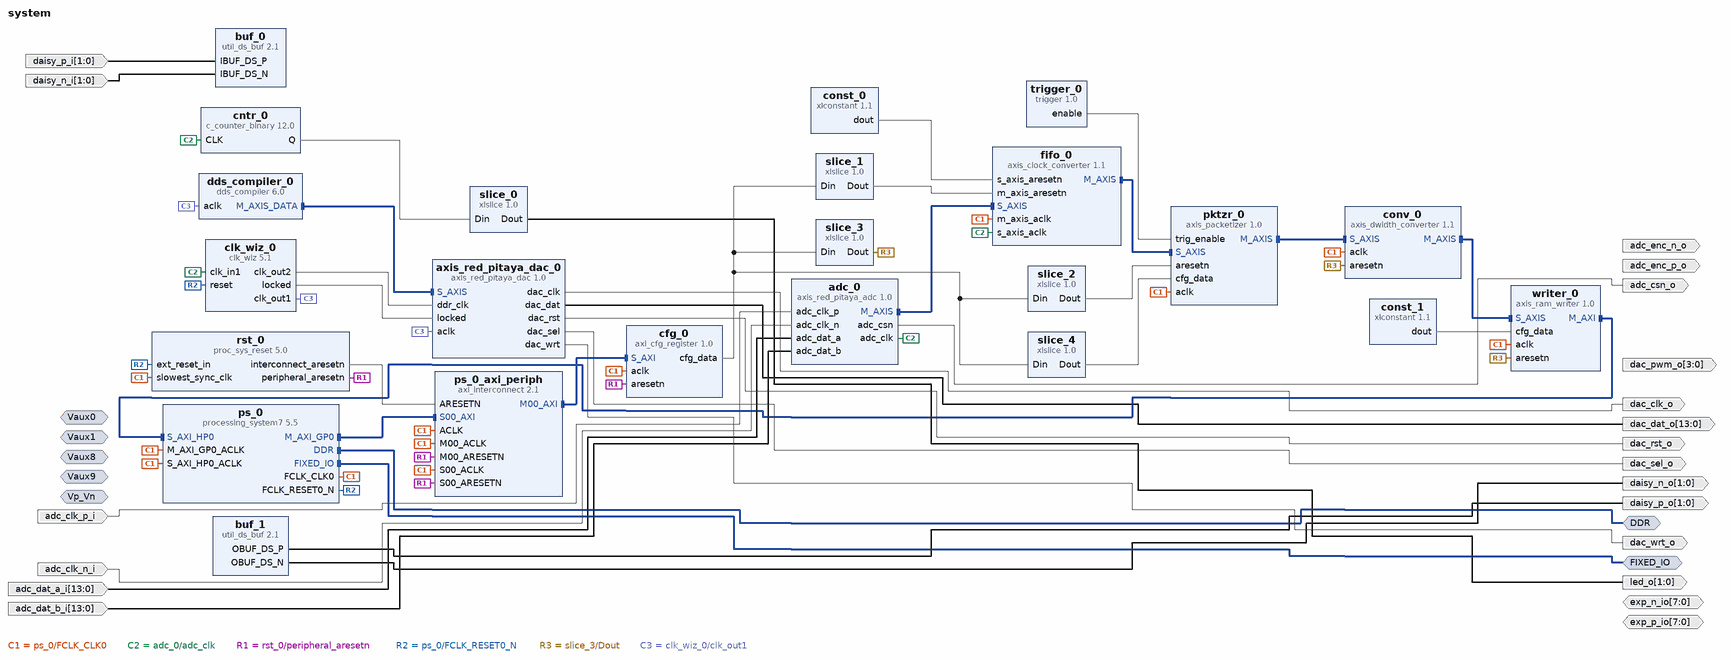
[diagram p0: block diagram of the top level]
# Vivado block design system, Vivado 2015.2
create_bd_design system

create_bd_intf_port -mode Master -vlnv xilinx.com:interface:ddrx_rtl:1.0 DDR
create_bd_intf_port -mode Master -vlnv xilinx.com:display_processing_system7:fixedio_rtl:1.0 FIXED_IO
create_bd_intf_port -mode Slave -vlnv xilinx.com:interface:diff_analog_io_rtl:1.0 Vp_Vn
create_bd_intf_port -mode Slave -vlnv xilinx.com:interface:diff_analog_io_rtl:1.0 Vaux0
create_bd_intf_port -mode Slave -vlnv xilinx.com:interface:diff_analog_io_rtl:1.0 Vaux1
create_bd_intf_port -mode Slave -vlnv xilinx.com:interface:diff_analog_io_rtl:1.0 Vaux9
create_bd_intf_port -mode Slave -vlnv xilinx.com:interface:diff_analog_io_rtl:1.0 Vaux8
create_bd_port -dir O adc_enc_p_o
create_bd_port -dir O adc_enc_n_o
create_bd_port -dir O -from 3 -to 0 dac_pwm_o
create_bd_port -dir IO -from 7 -to 0 exp_p_io
create_bd_port -dir IO -from 7 -to 0 exp_n_io
create_bd_port -dir I -from 1 -to 0 daisy_p_i
create_bd_port -dir I -from 1 -to 0 daisy_n_i
create_bd_port -dir O -from 1 -to 0 daisy_p_o
create_bd_port -dir O -from 1 -to 0 daisy_n_o
create_bd_port -dir I adc_clk_p_i
create_bd_port -dir I adc_clk_n_i
create_bd_port -dir I -from 13 -to 0 adc_dat_a_i
create_bd_port -dir I -from 13 -to 0 adc_dat_b_i
create_bd_port -dir O adc_csn_o
create_bd_port -dir O -from 1 -to 0 led_o
create_bd_port -dir O dac_clk_o
create_bd_port -dir O -from 13 -to 0 dac_dat_o
create_bd_port -dir O dac_rst_o
create_bd_port -dir O dac_sel_o
create_bd_port -dir O dac_wrt_o

create_bd_cell -type ip -vlnv xilinx.com:ip:processing_system7:5.5 ps_0
set_property -dict {CONFIG.PCW_USE_S_AXI_HP0 1 CONFIG.PCW_IMPORT_BOARD_PRESET cfg/red_pitaya.xml} [get_bd_cells ps_0]
create_bd_cell -type ip -vlnv xilinx.com:ip:proc_sys_reset:5.0 rst_0
create_bd_cell -type ip -vlnv xilinx.com:ip:util_ds_buf:2.1 buf_0
set_property -dict {CONFIG.C_SIZE 2 CONFIG.C_BUF_TYPE IBUFDS} [get_bd_cells buf_0]
create_bd_cell -type ip -vlnv xilinx.com:ip:util_ds_buf:2.1 buf_1
set_property -dict {CONFIG.C_SIZE 2 CONFIG.C_BUF_TYPE OBUFDS} [get_bd_cells buf_1]
create_bd_cell -type ip -vlnv pavel-demin:user:axis_red_pitaya_adc:1.0 adc_0
create_bd_cell -type ip -vlnv xilinx.com:ip:c_counter_binary:12.0 cntr_0
set_property -dict {CONFIG.Output_Width 32} [get_bd_cells cntr_0]
create_bd_cell -type ip -vlnv xilinx.com:ip:xlslice:1.0 slice_0
set_property -dict {CONFIG.DOUT_WIDTH 2 CONFIG.DIN_TO 25 CONFIG.DIN_FROM 26 CONFIG.DIN_WIDTH 32} [get_bd_cells slice_0]
create_bd_cell -type ip -vlnv pavel-demin:user:axi_cfg_register:1.0 cfg_0
set_property -dict {CONFIG.CFG_DATA_WIDTH 64 CONFIG.AXI_DATA_WIDTH 32 CONFIG.AXI_ADDR_WIDTH 32} [get_bd_cells cfg_0]
create_bd_cell -type ip -vlnv xilinx.com:ip:xlslice:1.0 slice_1
set_property -dict {CONFIG.DOUT_WIDTH 1 CONFIG.DIN_TO 0 CONFIG.DIN_FROM 0 CONFIG.DIN_WIDTH 64} [get_bd_cells slice_1]
create_bd_cell -type ip -vlnv xilinx.com:ip:xlslice:1.0 slice_2
set_property -dict {CONFIG.DOUT_WIDTH 1 CONFIG.DIN_TO 1 CONFIG.DIN_FROM 1 CONFIG.DIN_WIDTH 64} [get_bd_cells slice_2]
create_bd_cell -type ip -vlnv xilinx.com:ip:xlslice:1.0 slice_3
set_property -dict {CONFIG.DOUT_WIDTH 1 CONFIG.DIN_TO 2 CONFIG.DIN_FROM 2 CONFIG.DIN_WIDTH 64} [get_bd_cells slice_3]
create_bd_cell -type ip -vlnv xilinx.com:ip:xlslice:1.0 slice_4
set_property -dict {CONFIG.DOUT_WIDTH 32 CONFIG.DIN_TO 32 CONFIG.DIN_FROM 63 CONFIG.DIN_WIDTH 64} [get_bd_cells slice_4]
create_bd_cell -type ip -vlnv xilinx.com:ip:xlconstant:1.1 const_0
create_bd_cell -type ip -vlnv xilinx.com:ip:axis_clock_converter:1.1 fifo_0
create_bd_cell -type ip -vlnv xilinx.com:ip:axis_dwidth_converter:1.1 conv_0
set_property -dict {CONFIG.S_TDATA_NUM_BYTES 4 CONFIG.M_TDATA_NUM_BYTES 8} [get_bd_cells conv_0]
create_bd_cell -type ip -vlnv xilinx.com:ip:xlconstant:1.1 const_1
set_property -dict {CONFIG.CONST_WIDTH 32 CONFIG.CONST_VAL 503316480} [get_bd_cells const_1]
create_bd_cell -type ip -vlnv xilinx.com:ip:axi_interconnect:2.1 ps_0_axi_periph
set_property -dict {CONFIG.NUM_MI 1} [get_bd_cells ps_0_axi_periph]
create_bd_cell -type ip -vlnv pavel-demin:user:axis_ram_writer:1.0 writer_0
set_property -dict {CONFIG.ADDR_WIDTH 22} [get_bd_cells writer_0]
create_bd_cell -type ip -vlnv pavel-demin:user:axis_red_pitaya_dac:1.0 axis_red_pitaya_dac_0
create_bd_cell -type ip -vlnv xilinx.com:ip:dds_compiler:6.0 dds_compiler_0
set_property -dict [list \
  CONFIG.Amplitude_Mode Unit_Circle \
  CONFIG.Has_Phase_Out false \
  CONFIG.M_DATA_Has_TUSER Not_Required \
] [get_bd_cells dds_compiler_0]
create_bd_cell -type ip -vlnv xilinx.com:ip:clk_wiz:5.1 clk_wiz_0
set_property -dict [list \
  CONFIG.PRIMITIVE PLL \
  CONFIG.CLKOUT2_USED true \
  CONFIG.NUM_OUT_CLKS 2 \
  CONFIG.CLKOUT1_DRIVES BUFG \
  CONFIG.CLKOUT2_DRIVES BUFG \
  CONFIG.CLKOUT3_DRIVES BUFG \
  CONFIG.CLKOUT4_DRIVES BUFG \
  CONFIG.CLKOUT5_DRIVES BUFG \
  CONFIG.CLKOUT6_DRIVES BUFG \
  CONFIG.CLKOUT7_DRIVES BUFG \
  CONFIG.MMCM_DIVCLK_DIVIDE 1 \
  CONFIG.MMCM_CLKFBOUT_MULT_F 8 \
  CONFIG.MMCM_COMPENSATION ZHOLD \
  CONFIG.MMCM_CLKOUT0_DIVIDE_F 8 \
  CONFIG.MMCM_CLKOUT1_DIVIDE 8 \
  CONFIG.CLKOUT1_JITTER 144.719 \
  CONFIG.CLKOUT1_PHASE_ERROR 114.212 \
  CONFIG.CLKOUT2_JITTER 144.719 \
  CONFIG.CLKOUT2_PHASE_ERROR 114.212 \
] [get_bd_cells clk_wiz_0]
create_bd_cell -type ip -vlnv pavel-demin:user:axis_packetizer:1.0 pktzr_0
set_property -dict {CONFIG.AXIS_TDATA_WIDTH 32 CONFIG.CNTR_WIDTH 32 CONFIG.CONTINUOUS FALSE} [get_bd_cells pktzr_0]
create_bd_cell -type ip -vlnv user.org:user:trigger:1.0 trigger_0

# ---- connections ----

connect_bd_intf_net [get_bd_intf_pins ps_0/M_AXI_GP0] [get_bd_intf_pins ps_0_axi_periph/S00_AXI]
connect_bd_intf_net [get_bd_intf_pins ps_0_axi_periph/M00_AXI] [get_bd_intf_pins cfg_0/S_AXI]
connect_bd_intf_net [get_bd_intf_pins fifo_0/S_AXIS] [get_bd_intf_pins adc_0/M_AXIS]
connect_bd_intf_net [get_bd_intf_pins conv_0/S_AXIS] [get_bd_intf_pins pktzr_0/M_AXIS]
connect_bd_intf_net [get_bd_intf_pins writer_0/S_AXIS] [get_bd_intf_pins conv_0/M_AXIS]
connect_bd_intf_net [get_bd_intf_pins writer_0/M_AXI] [get_bd_intf_pins ps_0/S_AXI_HP0]
connect_bd_intf_net [get_bd_intf_pins pktzr_0/S_AXIS] [get_bd_intf_pins fifo_0/M_AXIS]
connect_bd_intf_net [get_bd_intf_pins dds_compiler_0/M_AXIS_DATA] [get_bd_intf_pins axis_red_pitaya_dac_0/S_AXIS]
connect_bd_intf_net [get_bd_intf_ports DDR] [get_bd_intf_pins ps_0/DDR]
connect_bd_intf_net [get_bd_intf_ports FIXED_IO] [get_bd_intf_pins ps_0/FIXED_IO]
connect_bd_net [get_bd_pins ps_0/FCLK_CLK0] \
  [get_bd_pins ps_0/M_AXI_GP0_ACLK] [get_bd_pins ps_0/S_AXI_HP0_ACLK] [get_bd_pins rst_0/slowest_sync_clk] \
  [get_bd_pins cfg_0/aclk] [get_bd_pins fifo_0/m_axis_aclk] [get_bd_pins conv_0/aclk] [get_bd_pins writer_0/aclk] \
  [get_bd_pins ps_0_axi_periph/ACLK] [get_bd_pins ps_0_axi_periph/S00_ACLK] [get_bd_pins ps_0_axi_periph/M00_ACLK] \
  [get_bd_pins pktzr_0/aclk]
connect_bd_net [get_bd_ports daisy_p_i] [get_bd_pins buf_0/IBUF_DS_P]
connect_bd_net [get_bd_ports daisy_n_i] [get_bd_pins buf_0/IBUF_DS_N]
connect_bd_net [get_bd_pins buf_1/OBUF_DS_P] [get_bd_ports daisy_p_o]
connect_bd_net [get_bd_pins buf_1/OBUF_DS_N] [get_bd_ports daisy_n_o]
connect_bd_net [get_bd_ports adc_clk_p_i] [get_bd_pins adc_0/adc_clk_p]
connect_bd_net [get_bd_ports adc_clk_n_i] [get_bd_pins adc_0/adc_clk_n]
connect_bd_net [get_bd_ports adc_dat_a_i] [get_bd_pins adc_0/adc_dat_a]
connect_bd_net [get_bd_ports adc_dat_b_i] [get_bd_pins adc_0/adc_dat_b]
connect_bd_net [get_bd_pins adc_0/adc_csn] [get_bd_ports adc_csn_o]
connect_bd_net [get_bd_pins adc_0/adc_clk] [get_bd_pins cntr_0/CLK] [get_bd_pins fifo_0/s_axis_aclk] [get_bd_pins clk_wiz_0/clk_in1]
connect_bd_net [get_bd_pins cntr_0/Q] [get_bd_pins slice_0/Din]
connect_bd_net [get_bd_pins slice_0/Dout] [get_bd_ports led_o]
connect_bd_net [get_bd_pins rst_0/peripheral_aresetn] \
  [get_bd_pins cfg_0/aresetn] [get_bd_pins ps_0_axi_periph/S00_ARESETN] [get_bd_pins ps_0_axi_periph/M00_ARESETN]
connect_bd_net [get_bd_pins ps_0/FCLK_RESET0_N] [get_bd_pins rst_0/ext_reset_in] [get_bd_pins clk_wiz_0/reset]
connect_bd_net [get_bd_pins rst_0/interconnect_aresetn] [get_bd_pins ps_0_axi_periph/ARESETN]
connect_bd_net [get_bd_pins cfg_0/cfg_data] [get_bd_pins slice_1/Din] [get_bd_pins slice_2/Din] [get_bd_pins slice_3/Din] [get_bd_pins slice_4/Din]
connect_bd_net [get_bd_pins const_0/dout] [get_bd_pins fifo_0/s_axis_aresetn]
connect_bd_net [get_bd_pins slice_1/Dout] [get_bd_pins fifo_0/m_axis_aresetn]
connect_bd_net [get_bd_pins slice_4/Dout] [get_bd_pins pktzr_0/cfg_data]
connect_bd_net [get_bd_pins slice_2/Dout] [get_bd_pins pktzr_0/aresetn]
connect_bd_net [get_bd_pins slice_3/Dout] [get_bd_pins conv_0/aresetn] [get_bd_pins writer_0/aresetn]
connect_bd_net [get_bd_pins const_1/dout] [get_bd_pins writer_0/cfg_data]
connect_bd_net [get_bd_pins clk_wiz_0/clk_out1] [get_bd_pins dds_compiler_0/aclk] [get_bd_pins axis_red_pitaya_dac_0/aclk]
connect_bd_net [get_bd_pins clk_wiz_0/clk_out2] [get_bd_pins axis_red_pitaya_dac_0/ddr_clk]
connect_bd_net [get_bd_pins clk_wiz_0/locked] [get_bd_pins axis_red_pitaya_dac_0/locked]
connect_bd_net [get_bd_pins axis_red_pitaya_dac_0/dac_clk] [get_bd_ports dac_clk_o]
connect_bd_net [get_bd_pins axis_red_pitaya_dac_0/dac_dat] [get_bd_ports dac_dat_o]
connect_bd_net [get_bd_pins axis_red_pitaya_dac_0/dac_rst] [get_bd_ports dac_rst_o]
connect_bd_net [get_bd_pins axis_red_pitaya_dac_0/dac_sel] [get_bd_ports dac_sel_o]
connect_bd_net [get_bd_pins axis_red_pitaya_dac_0/dac_wrt] [get_bd_ports dac_wrt_o]
connect_bd_net [get_bd_pins trigger_0/enable] [get_bd_pins pktzr_0/trig_enable]

# ---- address map ----
assign_bd_address -offset 0x40000000 -range 4K -target_address_space [get_bd_addr_spaces ps_0/Data] [get_bd_addr_segs cfg_0/s_axi/reg0]
assign_bd_address -offset 0x00000000 -range 512M -target_address_space [get_bd_addr_spaces writer_0/M_AXI] [get_bd_addr_segs ps_0/S_AXI_HP0/HP0_DDR_LOWOCM]

validate_bd_design
save_bd_design
